# Altium schematic sheet Ethernet.SchDoc
size 420 x 297 mm; Address1: Address1; Address2: Address2; Address3: Address3; Address4: Address4; DocumentNumber: *Э3; SheetNumber: 13; SheetTotal: 14; DocumentType: Схема электрическая *
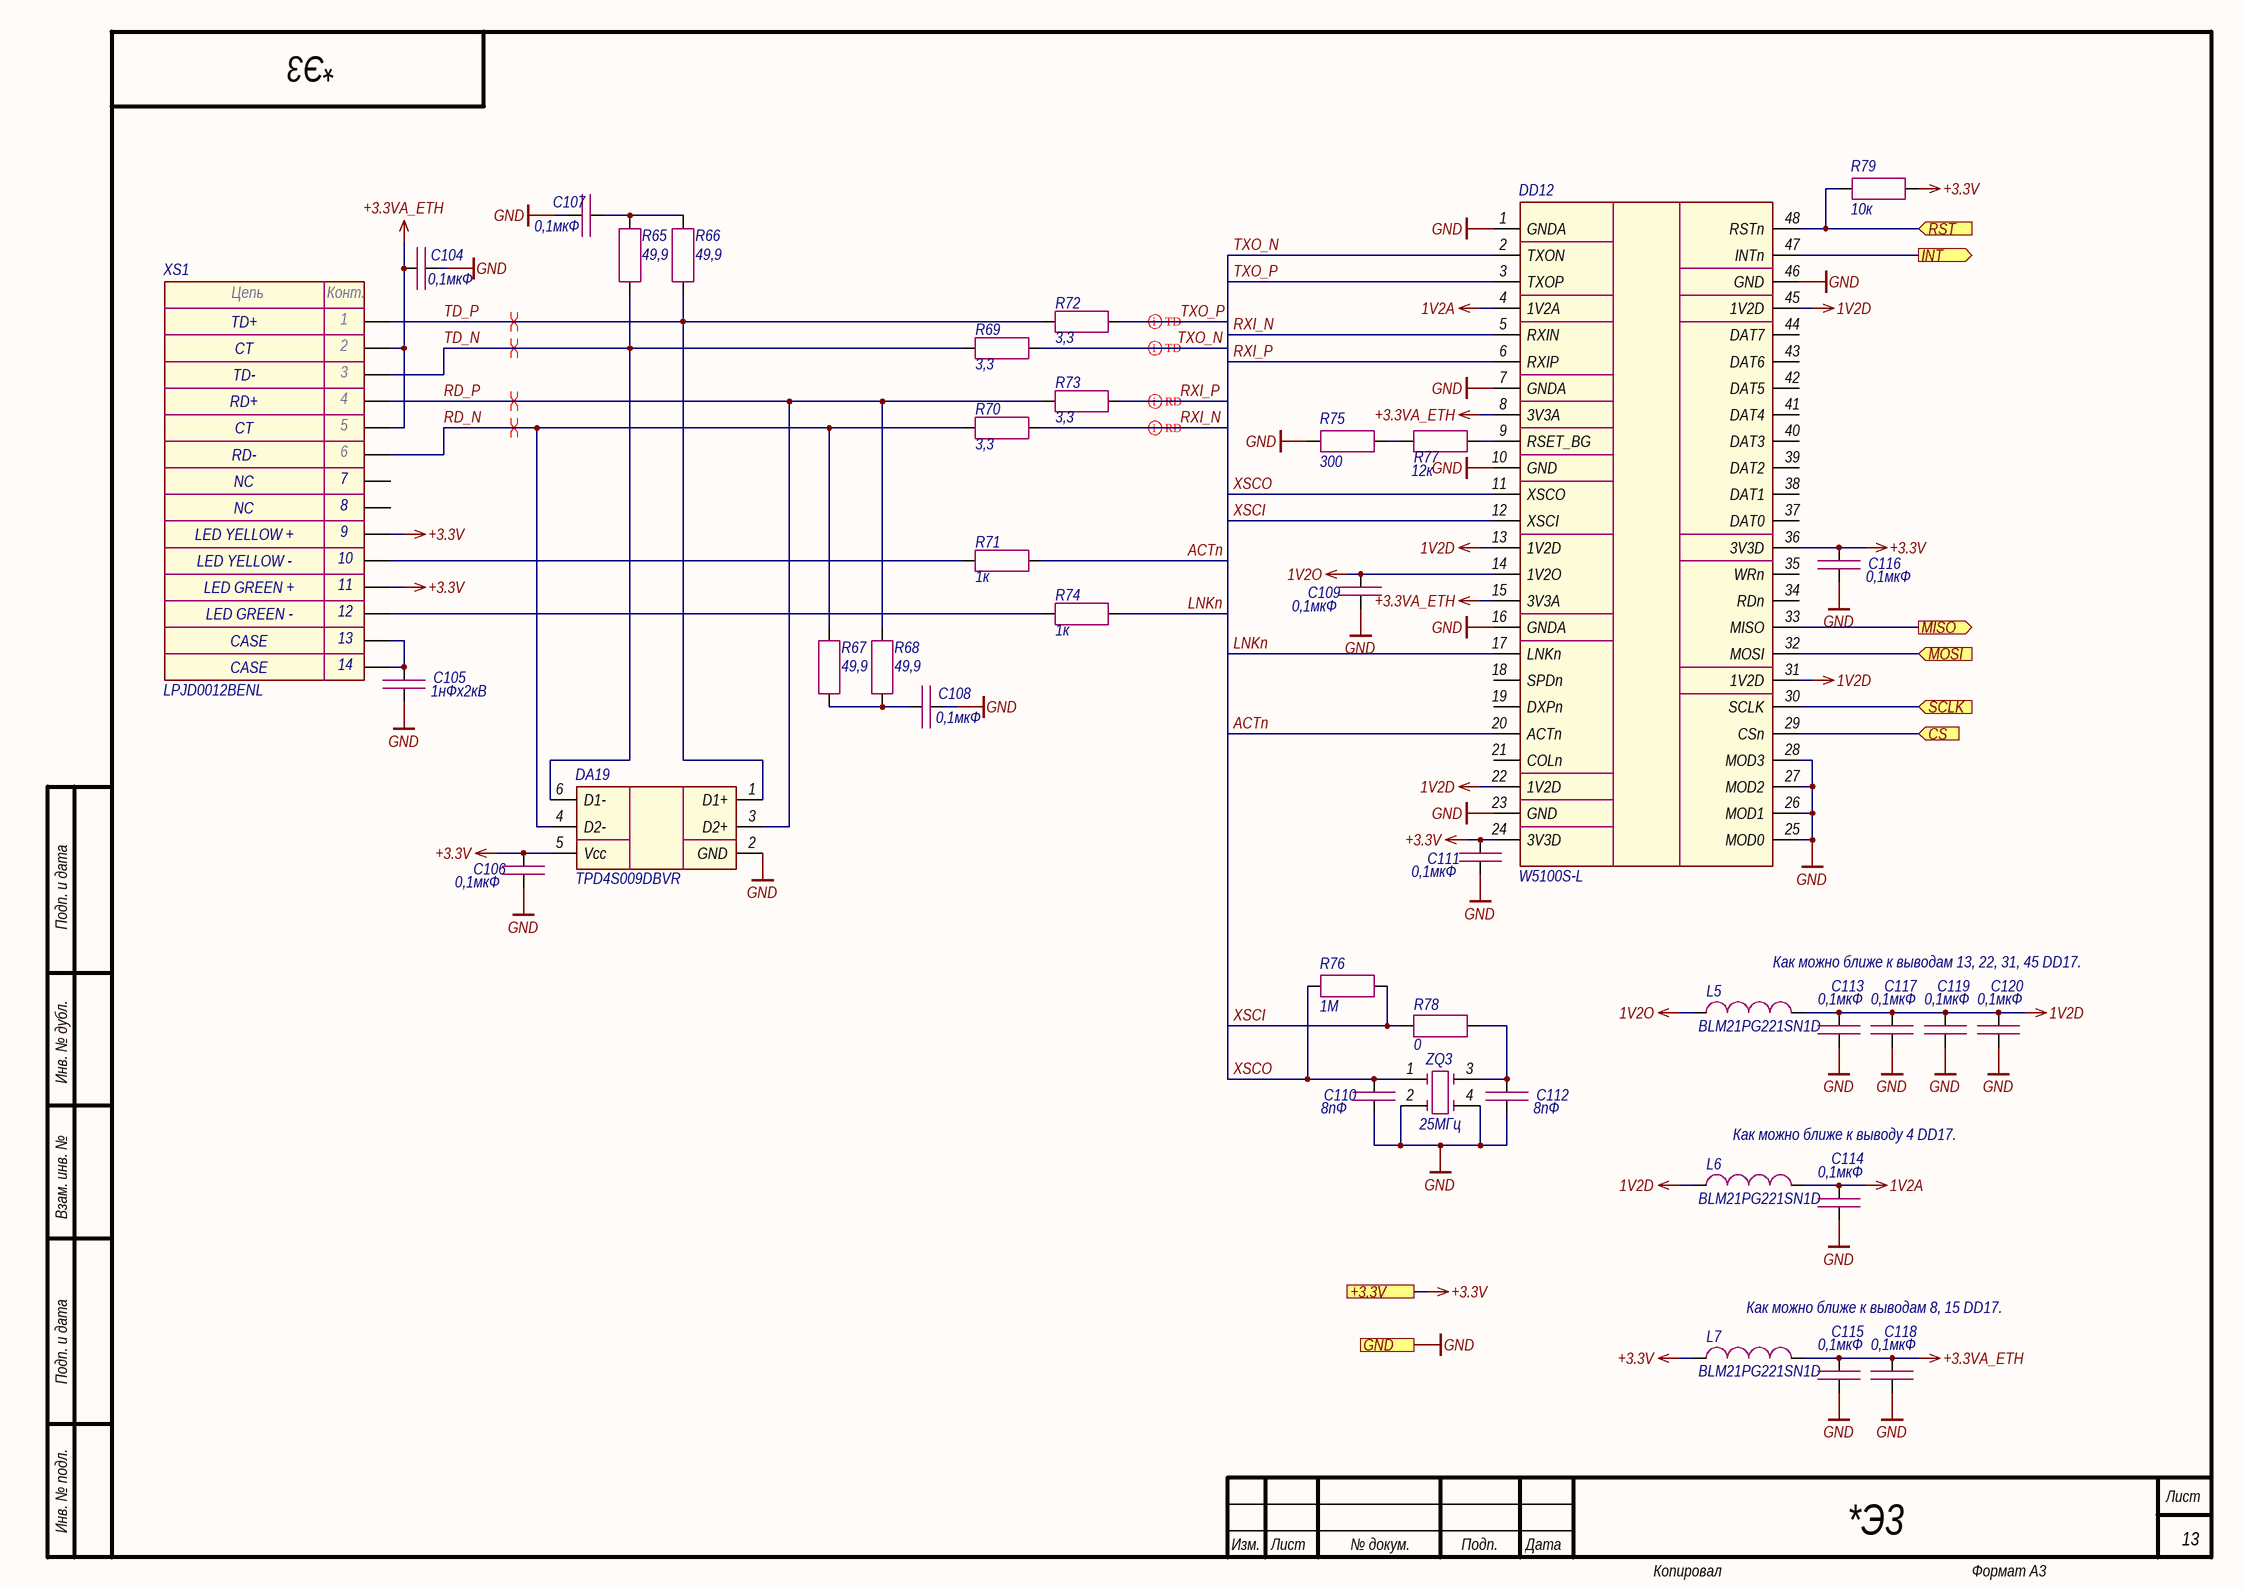
[diagram p0: Ethernet.SchDoc]

## Parts
C104  0,1мкФ  [CAP_0603]
C105  1нФх2кВ  [CAP_1206]
C106  0,1мкФ  [CAP_0603]
C107  0,1мкФ  [CAP_0603]
C108  0,1мкФ  [CAP_0603]
C109  0,1мкФ  [CAP_0603]
C110  8пФ  [CAP_0603]
C111  0,1мкФ  [CAP_0603]
C112  8пФ  [CAP_0603]
C113  0,1мкФ  [CAP_0603]
C114  0,1мкФ  [CAP_0603]
C115  0,1мкФ  [CAP_0603]
C116  0,1мкФ  [CAP_0603]
C117  0,1мкФ  [CAP_0603]
C118  0,1мкФ  [CAP_0603]
C119  0,1мкФ  [CAP_0603]
C120  0,1мкФ  [CAP_0603]
DA19  TPD4S009DBVR  [SOT-23-6]
DD12  W5100S-L  [LQFP-48]
L5  BLM21PG221SN1D  [IND_0805]
L6  BLM21PG221SN1D  [IND_0805]
L7  BLM21PG221SN1D  [IND_0805]
R65  49,9  [RES_0603]
R66  49,9  [RES_0603]
R67  49,9  [RES_0603]
R68  49,9  [RES_0603]
R69  3,3  [RES_0603]
R70  3,3  [RES_0603]
R71  1к  [RES_0603]
R72  3,3  [RES_0603]
R73  3,3  [RES_0603]
R74  1к  [RES_0603]
R75  300  [RES_0603]
R76  1М  [RES_0603]
R77  12к  [RES_0603]
R78  0  [RES_0603]
R79  10к  [RES_0603]
XS1  LPJD0012BENL  [LPJD0012BENL]
ZQ3  25МГц  [7M]

## Ports
+3.3V (see Main[1C], Button[1D], Fiber_interlock[2C], Flow_sensor[2C], LD_driver[1D], Power_supply[2C], RS-485[2C]), CS (in, see Main[1C]), GND (see Main[1C], Button[1D], Column[1C], Fiber_interlock[2C], Flow_sensor[2C], Guide_laser[1C], Indication[1C], LD_driver[1D], Power_supply[2C], RS-485[2C]), INT (out, see Main[1C]), MISO (out, see Main[1C]), MOSI (in, see Main[1C]), RST (in, see Main[1C]), SCLK (in, see Main[1C])

## Nets
1V2A: C114.1 DD12.4(1V2A) L6.2
1V2D: C113.1 C117.1 C119.1 C120.1 DD12.13(1V2D) DD12.22(1V2D) DD12.31(1V2D) DD12.45(1V2D) L5.2 L6.1
1V2O: C109.1 DD12.14(1V2O) L5.1
+3.3V: C106.1 C111.1 C116.1 DA19.5(Vcc) DD12.24(3V3D) DD12.36(3V3D) L7.1 R79.2 XS1.9 XS1.11 ; port +3.3V
+3.3VA_ETH: C104.1 C115.1 C118.1 DD12.8(3V3A) DD12.15(3V3A) L7.2 XS1.2 XS1.5
GND: C104.2 C105.2 C106.2 C107.2 C108.2 C109.2 C110.2 C111.2 C112.2 C113.2 C114.2 C115.2 C116.2 C117.2 C118.2 C119.2 C120.2 DA19.2(GND) DD12.1(GNDA) DD12.7(GNDA) DD12.10(GND) DD12.16(GNDA) DD12.23(GND) DD12.25(MOD0) DD12.26(MOD1) DD12.27(MOD2) DD12.28(MOD3) DD12.46(GND) R75.1 ZQ3.2 ZQ3.4 ; port GND
ACTn: DD12.20(ACTn) R71.2
CS: DD12.29(CSn) ; port CS
INT: DD12.47(INTn) ; port INT
LNKn: DD12.17(LNKn) R74.2
MISO: DD12.33(MISO) ; port MISO
MOSI: DD12.32(MOSI) ; port MOSI
RD_N: DA19.4(D2-) R67.1 R70.2 XS1.6
RD_P: DA19.3(D2+) R68.1 R73.2 XS1.4
RST: DD12.48(RSTn) R79.1 ; port RST
RXI_N: DD12.5(RXIN) R70.1
RXI_P: DD12.6(RXIP) R73.1
SCLK: DD12.30(SCLK) ; port SCLK
TD_N: DA19.6(D1-) R65.1 R69.2 XS1.3
TD_P: DA19.1(D1+) R66.1 R72.2 XS1.1
TXO_N: DD12.2(TXON) R69.1
TXO_P: DD12.3(TXOP) R72.1
XSCI: DD12.12(XSCI) R76.2 R78.1
XSCO: C110.1 DD12.11(XSCO) R76.1 ZQ3.1
NetC105_1: C105.1 XS1.13 XS1.14
NetC107_1: C107.1 R65.2 R66.2
NetC108_1: C108.1 R67.2 R68.2
NetC112_1: C112.1 R78.2 ZQ3.3
NetDD12_9: DD12.9(RSET_BG) R77.2
NetR71_1: R71.1 XS1.10
NetR74_1: R74.1 XS1.12
NetR75_2: R75.2 R77.1

Not connected (* = marked no-connect by the designer): DD12 18(SPDn) 19(DXPn) 21(COLn) 34(RDn) 35(WRn) 37(DAT0) 38(DAT1) 39(DAT2) 40(DAT3) 41(DAT4) 42(DAT5) 43(DAT6) 44(DAT7); XS1 7 8

## Layout directives
differential pair; differential pair class TD: TXO_N, TXO_P
differential pair; differential pair class RD: RXI_N, RXI_P
differential pair: RD_N, RD_P, TD_N, TD_P

## Notes on the sheet
- Как можно ближе к выводам 13, 22, 31, 45 DD17.
- Как можно ближе к выводу 4 DD17.
- Как можно ближе к выводам 8, 15 DD17.
- Подп. и дата
- Инв. № дубл.
- Взам. инв. №
- Инв. № подл.
- Изм.
- Лист
- № докум.
- Подп.
- Дата
- Копировал
- Формат А3
- (in symbol LPJD0012BENL) Цепь; Конт.; TD+; CT; TD-; RD+; RD-; NC; LED YELLOW +; LED YELLOW -; LED GREEN +; LED GREEN -; CASE

## Library data of the parts
C104 C106-C109 C111 C113-C120 = Capacitor: Manufacturer: Murata; Model: GRM188R71H104KA93D; Value: 0,1мкФ; Document: *
C105 = Capacitor: Manufacturer: Yageo; Model: CC1206KKX7RDBB102; Value: 1нФх2кВ; Document: *
C110 C112 = Capacitor: Manufacturer: Yageo; Model: CC0603CRNPO9BN8R0; Value: 8пФ; Document: *
DA19 = TPD4S009: Manufacturer: Texas Instruments; Model: TPD4S009DBVR; Document: *
DD12 = W5100S: Manufacturer: Wiznet; Model: W5100S-L; Document: *
L5-L7 = Inductor: Manufacturer: Murata; Value: *; Model: BLM21PG221SN1D; Document: *
R65-R68 = Resistor: Manufacturer: Yageo; Model: RC0603FR-0749R9L; Value: 49,9; Document: *
R69 R70 R72 R73 = Resistor: Manufacturer: Yageo; Model: RC0603FR-073R3L; Value: 3,3; Document: *
R71 R74 = Resistor: Manufacturer: Yageo; Model: RC0603FR-071KL; Value: 1к; Document: *
R75 = Resistor: Manufacturer: Yageo; Model: RC0603FR-07300RL; Value: 300; Document: *
R76 = Resistor: Manufacturer: Yageo; Model: RC0603FR-071ML; Value: 1М; Document: *
R77 = Resistor: Manufacturer: Yageo; Model: RC0603FR-0712KL; Value: 12к; Document: *
R78 = Resistor: Manufacturer: Yageo; Model: RC0603FR-070RL; Value: 0; Document: *
R79 = Resistor: Manufacturer: Yageo; Model: RC0603FR-0710KL; Value: 10к; Document: *
XS1 = LPJD0012BENL: Manufacturer: LINK-PP; Model: LPJD0012BENL; Document: *
ZQ3 = Quartz_Resonator_4-pin: Manufacturer: TXC; Model: 7M-25.000MAAJ-T; Value: 25МГц; Document: *